# EAGLE design GCharger (EAGLE 6.5.0)
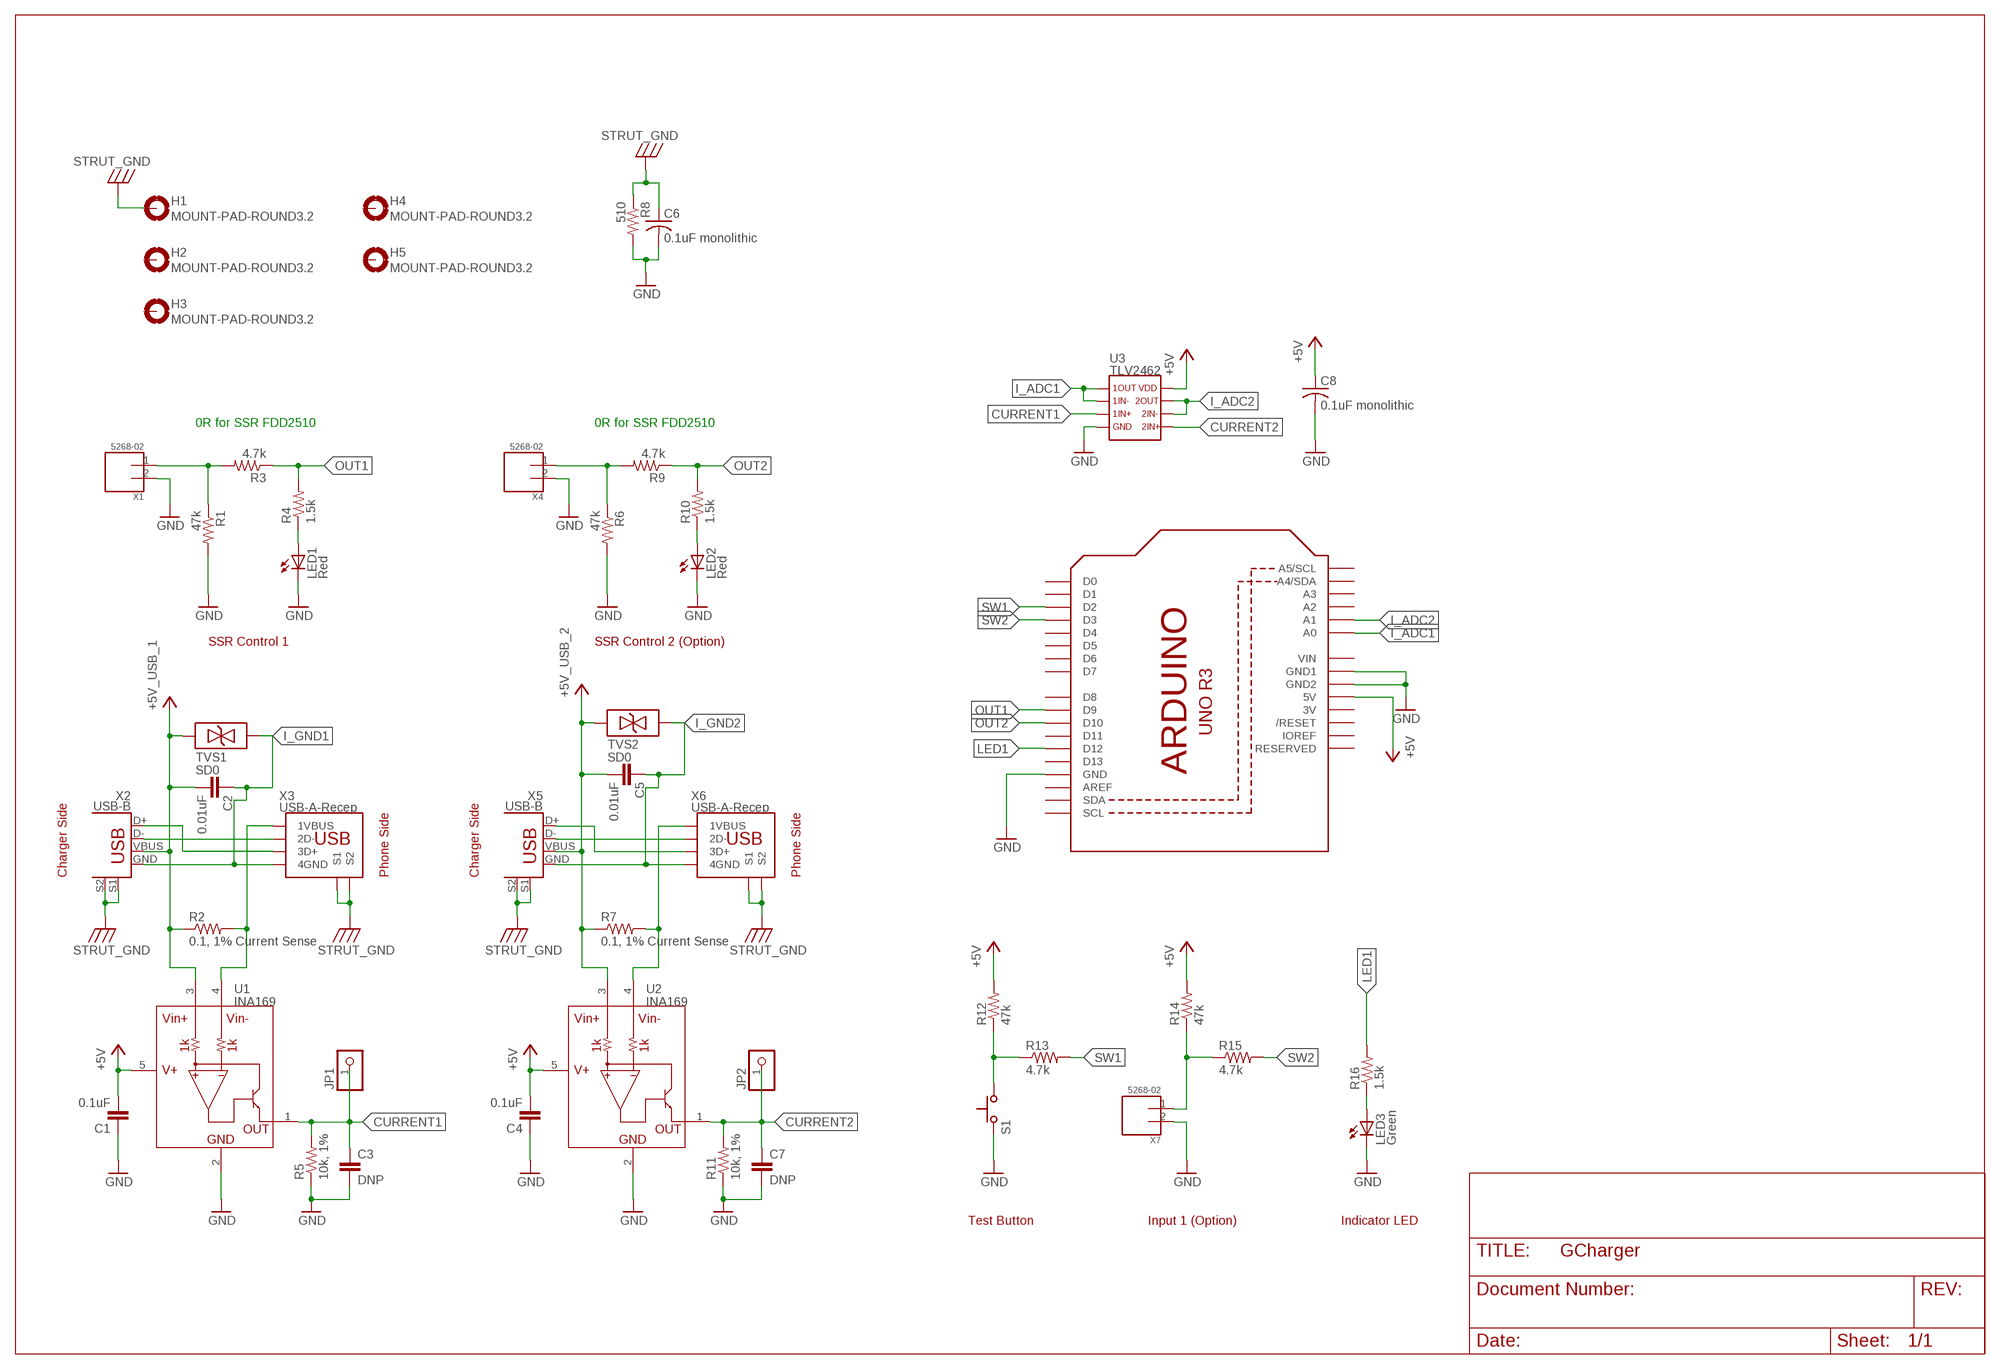
[diagram p0: schematic, sheet 1]

## Parts
C1  0.1uF  C0603(1608)  [C0603(1608)]
C2  0.01uF  C0603(1608)  [C0603(1608)]
C3  DNP  C0603(1608)  [C0603(1608)]
C4  0.1uF  C0603(1608)  [C0603(1608)]
C5  0.01uF  C0603(1608)  [C0603(1608)]
C6  0.1uF monolithic  C-US050-024X044  [C050-024X044]
C7  DNP  C0603(1608)  [C0603(1608)]
C8  0.1uF monolithic  C-US050-024X044  [C050-024X044]
H1  MOUNT-PAD-ROUND3.2  [3.2-PAD-ROUND]
H2  MOUNT-PAD-ROUND3.2  [3.2-PAD-ROUND]
H3  MOUNT-PAD-ROUND3.2  [3.2-PAD-ROUND]
H4  MOUNT-PAD-ROUND3.2  [3.2-PAD-ROUND]
H5  MOUNT-PAD-ROUND3.2  [3.2-PAD-ROUND]
JP1  PINHD-1X1CB  [1X01-CLEANBIG]
JP2  PINHD-1X1CB  [1X01-CLEANBIG]
LED1  Red  LED3MM  [LED3MM]
LED2  Red  LED3MM  [LED3MM]
LED3  Green  LED3MM  [LED3MM]
R1  47k  R-US_FLIPFLOP  [0805-THM]
R2  0.1, 1% Current Sense  RESISTOR1206  [1206]
R3  4.7k  R-US_FLIPFLOP  [0805-THM]
R4  1.5k  R-US_FLIPFLOP  [0805-THM]
R5  10k, 1%  R-US_FLIPFLOP  [0805-THM]
R6  47k  R-US_FLIPFLOP  [0805-THM]
R7  0.1, 1% Current Sense  RESISTOR1206  [1206]
R8  510  R-US_FLIPFLOP  [0805-THM]
R9  4.7k  R-US_FLIPFLOP  [0805-THM]
R10  1.5k  R-US_FLIPFLOP  [0805-THM]
R11  10k, 1%  R-US_FLIPFLOP  [0805-THM]
R12  47k  R-US_FLIPFLOP  [0805-THM]
R13  4.7k  R-US_FLIPFLOP  [0805-THM]
R14  47k  R-US_FLIPFLOP  [0805-THM]
R15  4.7k  R-US_FLIPFLOP  [0805-THM]
R16  1.5k  R-US_FLIPFLOP  [0805-THM]
S1  SWITCH  [SKHLACA010]
TVS1  SD0  [SOD-323]
TVS2  SD0  [SOD-323]
U1  INA169  [SOT23-5]
U2  INA169  [SOT23-5]
U3  TLV2462  [SO8]
U4  ARDUINOR3-TPLACE  [ARDUINOR3]
X1  5268-02  [5628-02]
X2  USB-B  USB+SHIELD  [USB-B-PTH]
X3  USB-A-Recep  USB-787616  [USB-A-RECEPT]
X4  5268-02  [5628-02]
X5  USB-B  USB+SHIELD  [USB-B-PTH]
X6  USB-A-Recep  USB-787616  [USB-A-RECEPT]
X7  5268-02  [5628-02]

## Nets
+5V: C1.2 C4.2 C8.1 R12.2 R14.2 U1.5(V+) U2.5(V+) U3.8 U4.5V
+5V_USB_1: C2.2 R2.1 TVS1.1 U1.3(VIN+) X2.VBUS
+5V_USB_2: C5.2 R7.1 TVS2.1 U2.3(VIN+) X5.VBUS
CURRENT1: C3.1 JP1.1 R5.2 U1.1(OUT) U3.3
CURRENT2: C7.1 JP2.1 R11.2 U2.1(OUT) U3.5
GND: C1.1 C3.2 C4.1 C6.2 C7.2 C8.2 LED1.K(C) LED2.K(C) LED3.K(C) R1.2 R5.1 R6.2 R8.2 R11.1 S1.P$1 U1.2(GND) U2.2(GND) U3.4 U4.GND U4.GND1 U4.GND2 X1.2 X4.2 X7.2
I_ADC1: U3.1 U3.2 U4.A0
I_ADC2: U3.6 U3.7 U4.A1
I_GND1: C2.1 TVS1.2 X2.GND X3.4(4GND)
I_GND2: C5.1 TVS2.2 X5.GND X6.4(4GND)
LED1: R16.2 U4.D12
N$1: X5.D- X6.2(2D-)
N$2: X5.D+ X6.3(3D+)
N$3: R1.1 R3.2 X1.1
N$4: X2.D- X3.2(2D-)
N$5: X2.D+ X3.3(3D+)
N$6: R7.2 U2.4(VIN-) X6.1(1VBUS)
N$7: R12.1 R13.1 S1.P$2
N$8: R6.1 R9.2 X4.1
N$9: R2.2 U1.4(VIN-) X3.1(1VBUS)
N$10: LED2.A R10.1
N$11: LED1.A R4.1
N$12: LED3.A R16.1
N$13: R14.1 R15.1 X7.1
OUT1: R3.1 R4.2 U4.D9
OUT2: R9.1 R10.2 U4.D10
STRUT_GND: C6.1 H1.B3,2(MOUNT) R8.1 X2.S1 X2.S2 X3.S1 X3.S2 X5.S1 X5.S2 X6.S1 X6.S2
SW1: R13.2 U4.D2
SW2: R15.2 U4.D3
Unconnected: H2.B3,2(MOUNT) H3.B3,2(MOUNT) H4.B3,2(MOUNT) H5.B3,2(MOUNT) U4.A2 U4.A3 U4.A4(A4/SDA) U4.A5(A5/SCL) U4.AREF U4.D0 U4.D1 U4.D4 U4.D5 U4.D6 U4.D7 U4.D8 U4.D11 U4.D13 U4.IOREF U4.RESERVED U4.RESET(/RESET) U4.SCL U4.SDA

## Notes on the sheet
- 0R for SSR FDD2510 | 0R for SSR FDD2510
- SSR Control 1 | SSR Control 2 (Option)
- Charger Side | Phone Side | Charger Side | Phone Side
- Test Button | Input 1 (Option) | Indicator LED

## Power pins joined to a net without a drawn wire
3V: U4.3V
VIN: U4.VIN

## Library data of the parts
C1 C2 C4 C5 = Gcharger:C
C3 C7 = g-project:C
C6 C8 = adafruit:C-US: CAPACITOR, American symbol
H1-H5 = OSSI:MOUNT-PAD-ROUND
JP1 JP2 = adafruit:PINHD-1X1: Pin header 1x1 for 0.1" spacing With round pins
LED1-LED3 = SparkFun-LED:LED: LEDs Standard schematic elements and footprints for 5mm, 3mm, 1206, and 0603 sized LEDs. 5mm - Spark Fun Electronics SKU : COM-00529 (and others)
R1 R3-R6 R8-R16 = g-project:R-US_: RESISTOR, American symbol
R2 R7 = SparkFun-Resistors:RESISTOR: Resistor Basic schematic elements and footprints for 0603, 1206, and PTH resistors.
S1 = WaterDrop:SWITCH
TVS1 TVS2 = Gcharger:SD0
U1 U2 = Gcharger:INA169
U3 = Gcharger:TLV2462
U4 = Gcharger:ARDUINOR3: This is a new object for the new Arduino R3 - with extra pins that you may want to use (such as IOref, and duplicated A4/A5
X1 X4 X7 = OSSI:5268-02
X2 X5 = Gcharger:USB+SHIELD: USB+Shield USB connector with shield pins connectable
X3 X6 = Gcharger:USB-787616: AMP connector

## Board
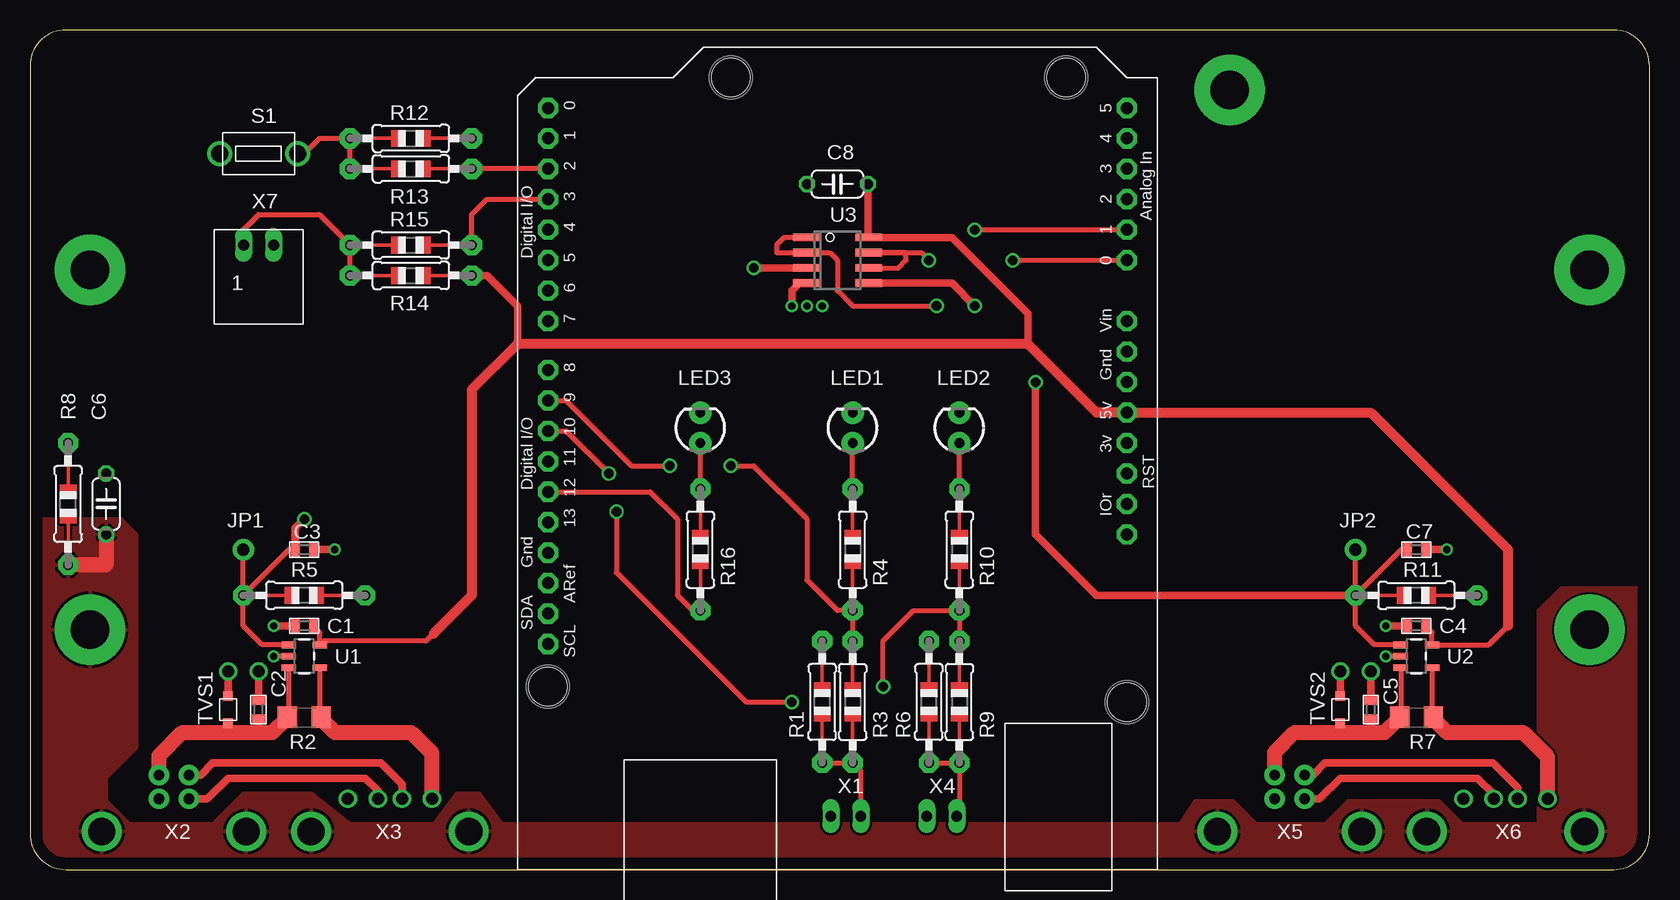
[diagram p1: board, top side]
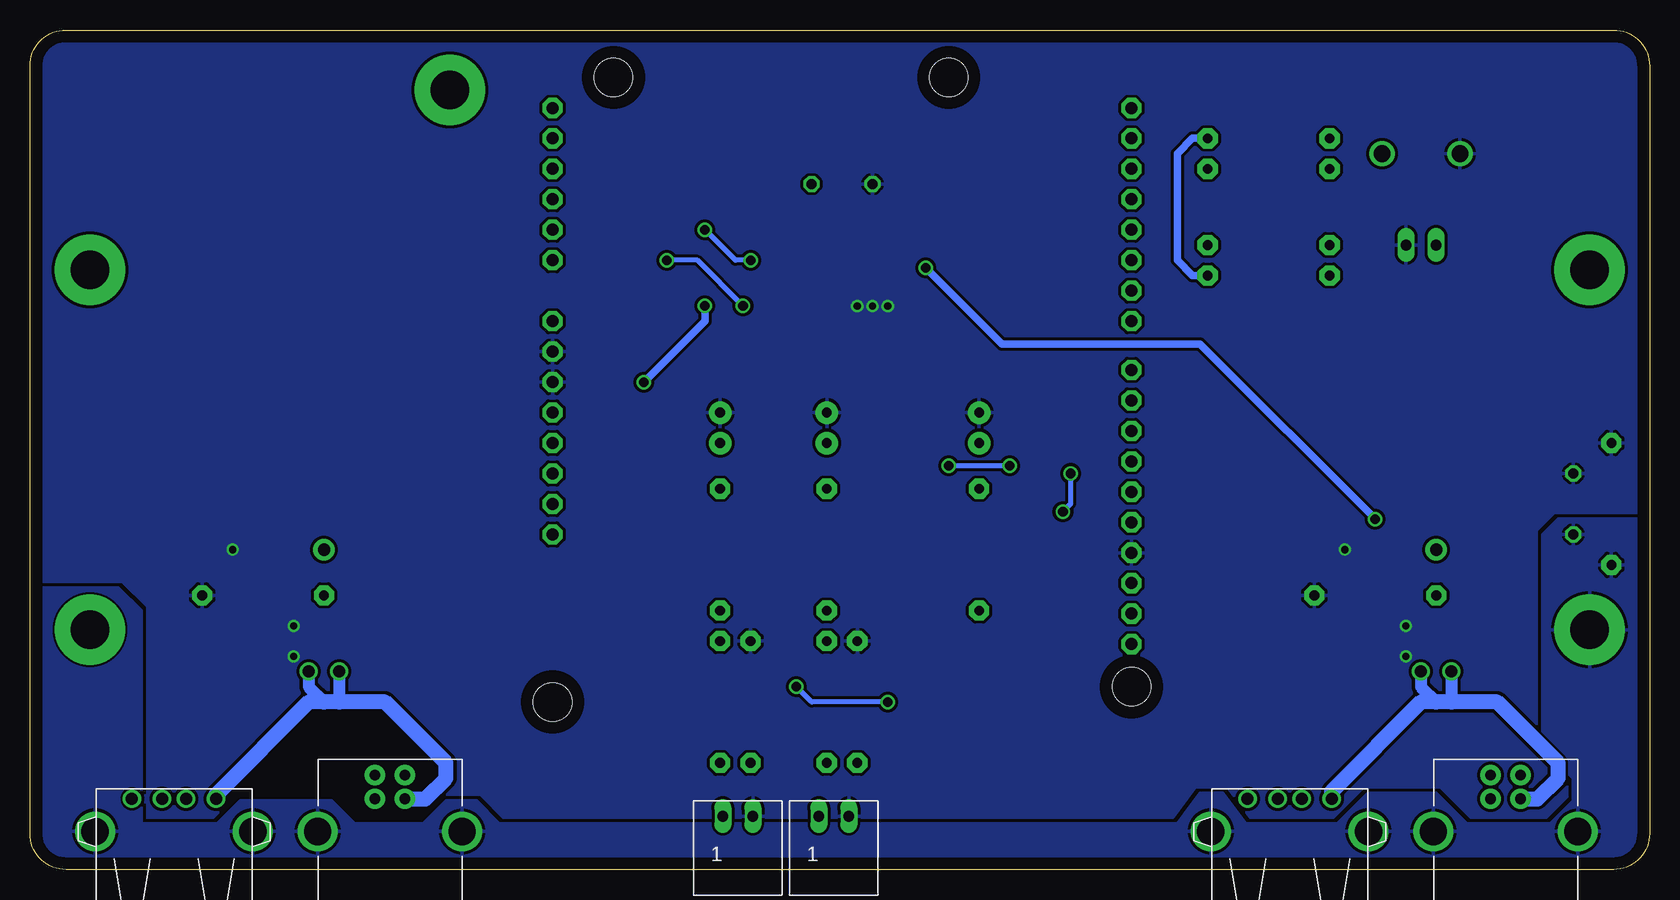
[diagram p2: board, bottom side, seen from below]

Size 135 x 70 mm. Coordinates in mm from the lower left corner, seen from the top.
Outline: 0,67 0,3 arc90 3,0 132,0 arc90 135,3 135,67 arc90 132,70 3,70 arc90 0,67
Copper layers (1*16): Top 0.035mm / dielectric 1.5mm / Bottom 0.035mm
Design rules "default *": minimum track width 10mil, minimum drill 24mil, track to track 8mil, track to pad 8mil, pad to pad 8mil, via to via 8mil, smd to smd 8mil, copper to edge 40mil, drill to drill 8mil, minimum pad ring 10mil, minimum via ring 8mil, stop-mask expansion 4mil, vias tented up to drill 0mil, thermal gap 10mil

### Footprints (pad centres in the part's own frame; a part is rotated, then mirrored left to right if it is on the bottom)
C0603(1608) = smd 0.7 x 1.1: 1 -0.75,0; 2 0.75,0
C050-024X044 = drill 0.813 octagon: 1 -2.54,0; 2 2.54,0
3.2-PAD-ROUND = drill 3.2 pad 5.842: B3,2 0,0
1X01-CLEANBIG = drill 1.016 pad 1.778: 1 0,0
LED3MM = drill 0.813 pad 1.88: A -1.27,0; K 1.27,0
0805-THM = drill 0.813 pad 1.676 octagon: 1 -5.08,0; 2 5.08,0
1206 = smd 1.6 x 1.8: 1 -1.4,0; 2 1.4,0
SKHLACA010 = drill 1.4: P$1 -3.25,0; P$2 3.25,0
SOD-323 = smd 0.8 x 0.8: 1 -1.125,0; 2 1.125,0
SOT23-5 = smd 0.55 x 1.2: 1 -0.95,-1.3; 2 0,-1.3; 3 0.95,-1.3; 4 0.95,1.3; 5 -0.95,1.3
SO8 = smd 0.65 x 2.2: 1 -1.905,-2.6; 2 -0.635,-2.6; 3 0.635,-2.6; 4 1.905,-2.6; 5 1.905,2.6; 6 0.635,2.6; 7 -0.635,2.6; 8 -1.905,2.6
ARDUINOR3 = drill 1 pad 1.676 octagon: 3V 35.56,2.54; 5V 38.1,2.54; A0 50.8,2.54; A1 53.34,2.54; A2 55.88,2.54; A3 58.42,2.54; A4 60.96,2.54; A5 63.5,2.54; AREF 23.876,50.8; D0 63.5,50.8; D1 60.96,50.8; D2 58.42,50.8; D3 55.88,50.8; D4 53.34,50.8; D5 50.8,50.8; D6 48.26,50.8; D7 45.72,50.8; D8 41.656,50.8; D9 39.116,50.8; D10 36.576,50.8; D11 34.036,50.8; D12 31.496,50.8; D13 28.956,50.8; GND 26.416,50.8; GND1 43.18,2.54; GND2 40.64,2.54; IOREF 30.48,2.54; RESERVED 27.94,2.54; RESET 33.02,2.54; SCL 18.796,50.8; SDA 21.336,50.8; VIN 45.72,2.54 | hole 3.2: 13.97,2.54; 15.24,50.8; 66.04,35.56; 66.04,7.62
5628-02 = drill 0.9 long: 1 1.25,0; 2 -1.25,0
USB-B-PTH = drill 0.914 pad 1.676: D+ 2.718,1.25; D- 4.699,1.25; GND 2.718,-1.25; VBUS 4.699,-1.25 | drill 2.286: S1 0,-6.02; S2 0,6.02
USB-A-RECEPT = drill 1: 1 -3.5,2.71; 2 -1,2.71; 3 1,2.71; 4 3.5,2.71 | drill 2.3: S1 -6.57,0; S2 6.57,0

### Placement (x,y rotation side)
C1  22.86,20.32 0 top
C2  19.05,13.34 270 top
C3  22.86,26.67 0 top
C4  115.57,20.32 0 top
C5  111.76,13.34 270 top
C6  6.35,30.48 90 top
C7  115.57,26.67 0 top
C8  67.31,57.15 180 top
H1  5,20 0 top
H2  5,50 0 top
H3  100,65 0 top
H4  130,50 0 top
H5  130,20 0 top
JP1  17.78,26.67 0 top
JP2  110.49,26.67 0 top
LED1  68.58,36.83 90 top
LED2  77.47,36.83 90 top
LED3  55.88,36.83 90 top
R1  66.04,13.97 90 top
R2  22.86,12.7 0 top
R3  68.58,13.97 270 top
R4  68.58,26.67 270 top
R5  22.86,22.86 180 top
R6  74.93,13.97 90 top
R7  115.57,12.7 0 top
R8  3.17,30.48 90 top
R9  77.47,13.97 270 top
R10  77.47,26.67 270 top
R11  115.57,22.86 180 top
R12  31.75,60.96 0 top
R13  31.75,58.42 0 top
R14  31.75,49.53 0 top
R15  31.75,52.07 0 top
R16  55.88,26.67 270 top
S1  19.05,59.69 0 top
TVS1  16.51,13.34 90 top
TVS2  109.22,13.34 90 top
U1  22.86,17.78 270 top
U2  115.56,17.78 270 top
U3  67.31,50.8 270 top
U4  93.98,0 90 top
X1  68,4.45 180 bottom
X2  12,3.17 90 bottom
X3  30,3.17 0 bottom
X4  76,4.45 180 bottom
X5  105,3.17 90 bottom
X6  123,3.17 0 bottom
X7  19.05,52.07 180 top

### Tracks (layer width: path | path; a pad name or v marks a point on that pad's centre or on a via)
+5V
  Top 0.406: C1.2 24.16,19.77 U1.5 24.48,19.05 33.02,19.05 33.66,19.68 | C4.2 116.86,19.78 U2.5 121.6,18.73 123.19,20.32
  Top 0.61: C8.1 69.85,52.77 U3.8 76.83,52.7 83.19,46.35 83.19,43.81 | R14.2 38.1,49.53 40.64,46.99 40.64,43.81
  Top 0.813: 33.66,19.68 36.83,22.86 36.83,40.01 40.64,43.81 83.19,43.81 88.9,38.1 U4.5V 111.76,38.1 123.19,26.67 123.19,20.32
  Bottom 0.61: R12.2 38.1,60.96 39.37,59.69 39.37,50.8 38.1,49.53 R14.2
+5V_USB_1
  Top 0.406: U1.3 21.56,12.8 R2.1
  Top 0.61: TVS1.1 16.51,11.43 | C2.2 19.05,11.43
  Top 1.27: X2.VBUS 10.75,9.48 12.7,11.43 16.51,11.43 19.05,11.43 20.19,11.43 R2.1
+5V_USB_2
  Top 0.406: U2.3 114.26,12.79 R7.1
  Top 0.61: TVS2.1 109.22,11.43 | C5.2 111.76,11.43
  Top 1.27: X5.VBUS 103.75,9.77 105.41,11.43 109.22,11.43 111.76,11.43 112.9,11.43 R7.1
CURRENT1  (via drill 0.8)
  Top 0.406: U1.1 19.37,18.73 17.78,20.32 R5.2 | R5.2 JP1.1 | C3.1 21.59,26.67 R5.2
  Top 0.61: C3.1 22.11,28.46 v22.86,29.21 | v60.33,50.16 U3.3
  Bottom 0.61: v22.86,29.21 37.47,43.81 53.98,43.81 v60.33,50.16
CURRENT2  (via drill 0.8)
  Top 0.406: U2.1 112.08,18.73 110.49,20.32 R11.2 | R11.2 JP2.1 | C7.1 114.3,26.67 R11.2
  Top 0.61: U3.5 76.83,48.9 v78.74,46.99 | v83.82,40.64 83.82,27.94 88.9,22.86 R11.2
  Bottom 0.61: v78.74,46.99 78.74,45.72 v83.82,40.64
GND  (via drill 0.6)
  Top 0.406: U1.2 v20.32,17.78 | U2.2 v113.03,17.78
  Top 0.61: C1.1 v20.32,20.32 | C4.1 v113.03,20.32 | C3.2 v25.4,26.67 | v118.11,26.67 C7.2 | U3.4 64.14,48.9 63.5,48.26 v63.5,46.99
  other vias: 64.77,46.99 66.04,46.99
  pour Bottom (isolate 0.254, rank 2): 0,0 0,71.12 135.89,71.12 135.89,0
I_ADC1  (via drill 0.8)
  Top 0.406: U3.1 62.87,52.7 62.23,52.07 62.23,51.44 U3.2 66.67,51.44 67.31,50.8 67.31,48.26 68.58,46.99 v75.56,46.99 | v81.92,50.8 U4.A0
  Bottom 0.406: v75.56,46.99 79.38,50.8 v81.92,50.8
I_ADC2  (via drill 0.8)
  Top 0.406: U3.6 72.39,50.16 73.03,50.8 73.03,51.44 U3.7 74.3,51.44 v74.93,50.8 | v78.74,53.34 U4.A1
  Bottom 0.406: v74.93,50.8 76.2,50.8 v78.74,53.34
I_GND1  (via drill 1)
  Top 0.61: TVS1.2 v16.51,16.51 | C2.1 v19.05,16.51
  Bottom 1.016: v16.51,16.51 16.51,13.97 | v19.05,16.51 19.05,15.24 17.78,13.97
  Bottom 1.27: X2.GND 9.35,5.89 7.62,7.62 7.62,8.89 12.7,13.97 16.51,13.97 17.78,13.97 19.05,13.97 26.5,6.52 X3.4
I_GND2  (via drill 1)
  Top 0.61: TVS2.2 v109.22,16.51 | C5.1 v111.76,16.51
  Bottom 1.016: v109.22,16.51 109.22,13.97 | v111.76,16.51 111.76,15.24 110.49,13.97
  Bottom 1.27: X5.GND 102.06,5.89 100.33,7.62 100.33,8.89 105.41,13.97 109.22,13.97 110.49,13.97 111.76,13.97 119.5,6.23 X6.4
LED1
  Top 0.406: U4.D12 51.69,31.5 53.98,29.21 53.98,22.86 55.24,21.59 R16.2
N$1
  Top 0.61: X5.D- 106.93,7.87 107.95,8.89 121.92,8.89 124,6.81 X6.2
N$2
  Top 0.61: X5.D+ 107.49,5.89 109.22,7.62 120.65,7.62 122,6.27 X6.3
N$3
  Top 0.406: R1.1 R3.2 69.25,8.22 X1.1
N$4
  Top 0.61: X2.D- 14.22,7.87 15.24,8.89 29.21,8.89 31,7.1 X3.2
N$5
  Top 0.61: X2.D+ 14.78,5.89 16.51,7.62 27.94,7.62 29,6.56 X3.3
N$6
  Top 0.406: U2.4 116.86,12.81 R7.2
  Top 1.27: R7.2 116.97,12.57 118.11,11.43 124.46,11.43 126.5,9.39 X6.1
N$7
  Top 0.406: R13.1 R12.1 24.13,60.96 22.86,59.69 S1.P$2
N$8
  Top 0.406: X4.1 77.47,4.67 R9.2 R6.1
N$9
  Top 0.406: U1.4 24.16,12.8 R2.2
  Top 1.27: R2.2 24.26,12.57 25.4,11.43 31.75,11.43 33.5,9.68 X3.1
N$10
  Top 0.406: R10.1 LED2.A
N$11
  Top 0.406: R4.1 LED1.A
N$12
  Top 0.406: R16.1 LED3.A
N$13
  Top 0.406: R14.1 R15.1 24.13,54.61 19.05,54.61 17.8,53.36 X7.1
OUT1  (via drill 0.8)
  Top 0.406: R3.1 R4.2 67.31,21.59 64.77,24.13 64.77,29.21 60.33,33.66 v58.42,33.66 | U4.D9 44.7,39.12 50.16,33.66 v53.34,33.66
  Bottom 0.406: v53.34,33.66 v58.42,33.66
OUT2  (via drill 0.8)
  Top 0.406: R9.1 R10.2 73.66,21.59 71.12,19.05 v71.12,15.24 | U4.D10 44.7,36.58 v48.26,33.02 | v48.9,29.84 48.9,24.77 59.69,13.97 v63.5,13.97
  Bottom 0.406: v48.26,33.02 48.26,30.48 v48.9,29.84 | v63.5,13.97 69.85,13.97 v71.12,15.24
STRUT_GND
  Top 1.27: C6.1 6.35,25.4 R8.1
  pour Top: 0,29.21 7.62,29.21 8.89,27.94 8.89,10.16 6.35,7.62 6.35,5.71 8.26,3.81 15.24,3.81 17.78,6.35 23.5,6.35 26.67,3.81 33.66,3.81 35.56,6.35 37.47,6.35 39.37,3.81 95.89,3.81 97.16,5.71 100.33,5.71 102.23,3.81 107.95,3.81 109.86,5.71 117.47,5.71 119.38,3.81 125.73,3.81 125.73,21.59 127.64,23.5 134.62,23.5 134.62,0 0,0
  pour Bottom: 0,29.21 7.62,29.21 8.89,27.94 8.89,10.16 6.35,7.62 6.35,5.71 8.26,3.81 15.24,3.81 17.78,6.35 23.5,6.35 26.04,3.81 33.66,3.81 35.56,6.35 37.47,6.35 39.37,3.81 95.89,3.81 97.79,5.71 100.33,5.71 102.23,3.81 107.95,3.81 109.86,5.71 117.47,5.71 119.38,3.81 125.73,3.81 125.73,21.59 127.64,23.5 134.62,23.5 134.62,0 0,0
SW1
  Top 0.406: U4.D2 R13.2
SW2
  Top 0.406: R15.2 36.83,54.61 38.1,55.88 U4.D3